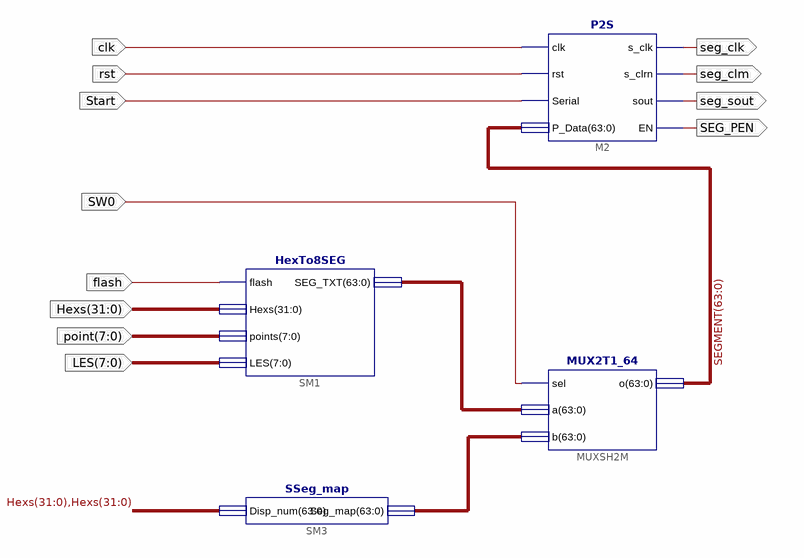
[diagram p0: schematic sheet 1]
// Xilinx ISE schematic SSeg7_Dev.sch (kintex7) as structural Verilog: 4 symbols, 12 ports
module SSeg7_Dev (
  input  clk,
  input  rst,
  input  Start,
  input  flash,
  input  [31:0] Hexs,
  input  [7:0] point,
  input  [7:0] LES,
  input  SW0,
  output seg_clk,
  output seg_clm,
  output seg_sout,
  output SEG_PEN
);

  wire [63:0] SEGMENT, XLXN_10, XLXN_11;

  P2S M2 (
    .clk(clk), .rst(rst), .Serial(Start), .P_Data(SEGMENT), .s_clk(seg_clk), .s_clrn(seg_clm),
    .sout(seg_sout), .EN(SEG_PEN));
  MUX2T1_64 MUXSH2M (.sel(SW0), .a(XLXN_10), .b(XLXN_11), .o(SEGMENT));
  HexTo8SEG SM1 (.flash(flash), .Hexs(Hexs), .points(point), .LES(LES), .SEG_TXT(XLXN_10));
  SSeg_map SM3 (.Disp_num({Hexs, Hexs}), .Seg_map(XLXN_11));
endmodule
